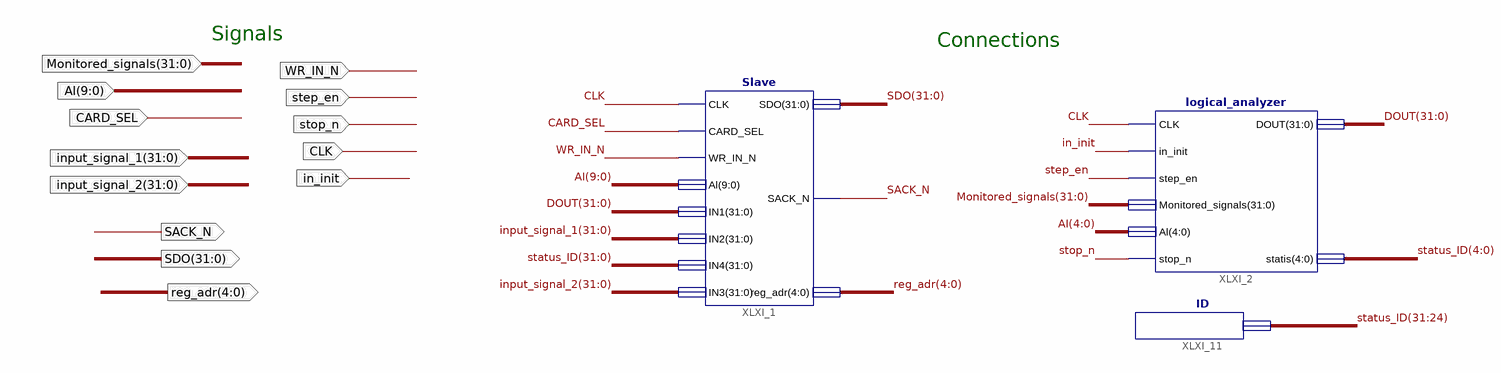
[diagram p0: schematic sheet 1]
// Xilinx ISE schematic Monitor.sch (spartan6) as structural Verilog: 3 symbols, 13 ports
module Monitor (
  input  WR_IN_N,
  input  stop_n,
  input  step_en,
  input  CLK,
  input  [31:0] Monitored_signals,
  input  [9:0] AI,
  input  CARD_SEL,
  input  [31:0] input_signal_2,
  input  [31:0] input_signal_1,
  input  in_init,
  output [31:0] SDO,
  output [4:0] reg_adr,
  output SACK_N
);

  wire [31:0] DOUT, status_ID;

  Slave XLXI_1 (
    .CLK(CLK), .CARD_SEL(CARD_SEL), .WR_IN_N(WR_IN_N), .Al(AI), .IN1(DOUT), .IN2(input_signal_1),
    .IN4(status_ID), .IN3(input_signal_2), .SDO(SDO), .SACK_N(SACK_N), .reg_adr(reg_adr));
  logical_analyzer XLXI_2 (
    .CLK(CLK), .in_init(in_init), .step_en(step_en), .Monitored_signals(Monitored_signals), .Al(AI[4:0]),
    .stop_n(stop_n), .DOUT(DOUT), .statis(status_ID[4:0]));
  ID XLXI_11 (.IDOUT(status_ID[31:24]));

  // Notes on the sheet:
  //   Signals
  //   Connections
endmodule
